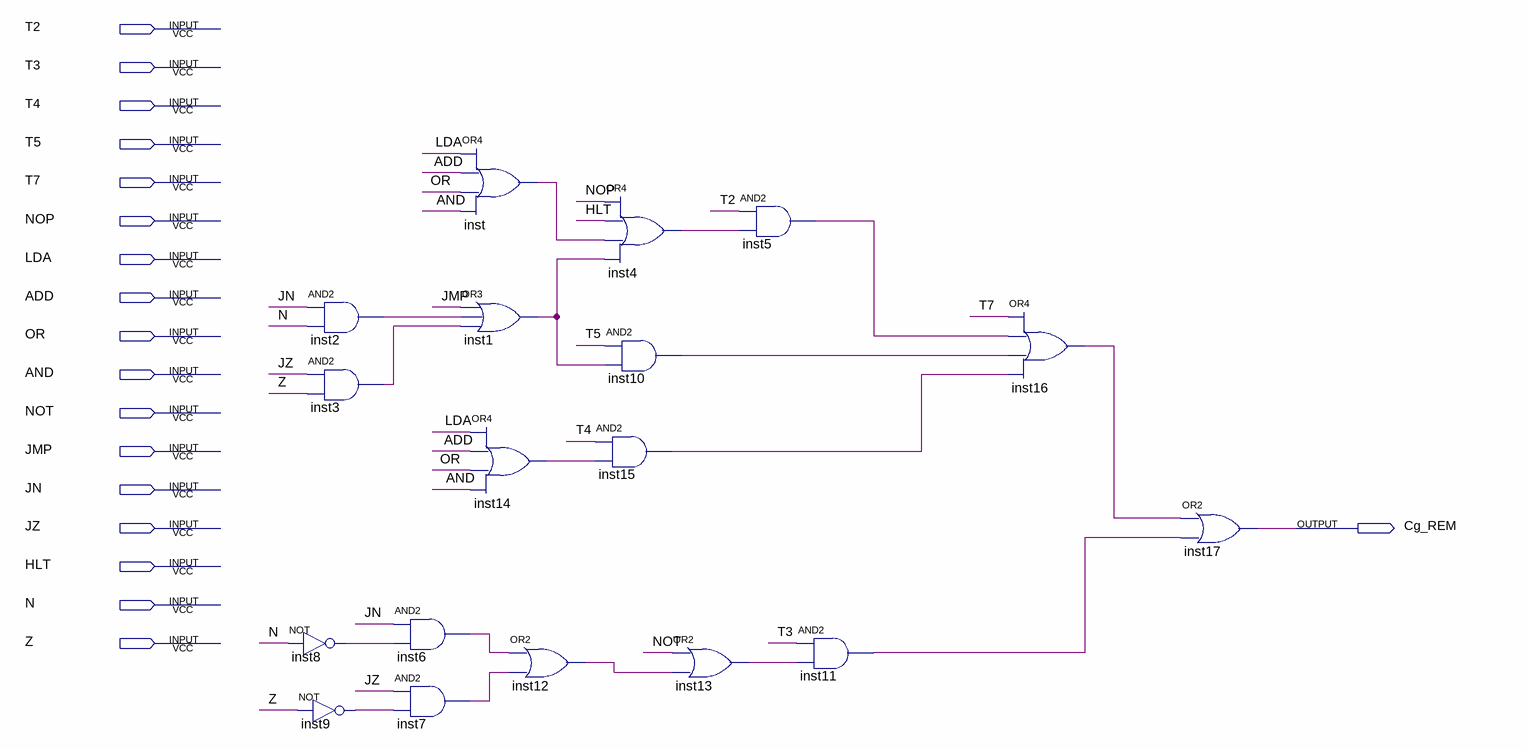
[diagram p0: schematic sheet]
// Quartus schematic abk_carga_rem.bdf as structural Verilog: 18 symbols, 18 pins
module abk_carga_rem (
  input  T2,
  input  T3,
  input  T4,
  input  T5,
  input  T7,
  input  NOP,
  input  LDA,
  input  ADD,
  input  OR,
  input  AND,
  input  NOT,
  input  JMP,
  input  JN,
  input  JZ,
  input  HLT,
  input  N,
  input  Z,
  output Cg_REM
);

  wire inst1_out, inst2_out, inst3_out, inst4_out, inst5_out, inst6_out, inst7_out, inst8_out, inst9_out,
       inst10_out, inst11_out, inst12_out, inst13_out, inst14_out, inst15_out, inst16_out, inst_out;

  and inst2 (inst2_out, JN, N);
  and inst3 (inst3_out, JZ, Z);
  not inst8 (inst8_out, N);
  not inst9 (inst9_out, Z);
  and inst6 (inst6_out, JN, inst8_out);
  and inst7 (inst7_out, JZ, inst9_out);
  or inst (inst_out, LDA, ADD, OR, AND);
  or inst1 (inst1_out, JMP, inst2_out, inst3_out);
  or inst14 (inst14_out, LDA, ADD, OR, AND);
  or inst12 (inst12_out, inst6_out, inst7_out);
  or inst4 (inst4_out, NOP, HLT, inst_out, inst1_out);
  and inst10 (inst10_out, T5, inst1_out);
  and inst15 (inst15_out, T4, inst14_out);
  and inst5 (inst5_out, T2, inst4_out);
  or inst13 (inst13_out, NOT, inst12_out);
  and inst11 (inst11_out, T3, inst13_out);
  or inst16 (inst16_out, T7, inst5_out, inst10_out, inst15_out);
  or inst17 (Cg_REM, inst16_out, inst11_out);
endmodule
